# EasyEDA Pro project CobraControl.epro

# Schematic Schematic1
Board Name: Board1; Create Date: 2025-09-19; Page Name: P1; Project Name: CobraControl; Schematic Name: Schematic1; Update Date: 2025-09-19; Company: EasyEDA.com; Page Size: A4; Version: V1.0
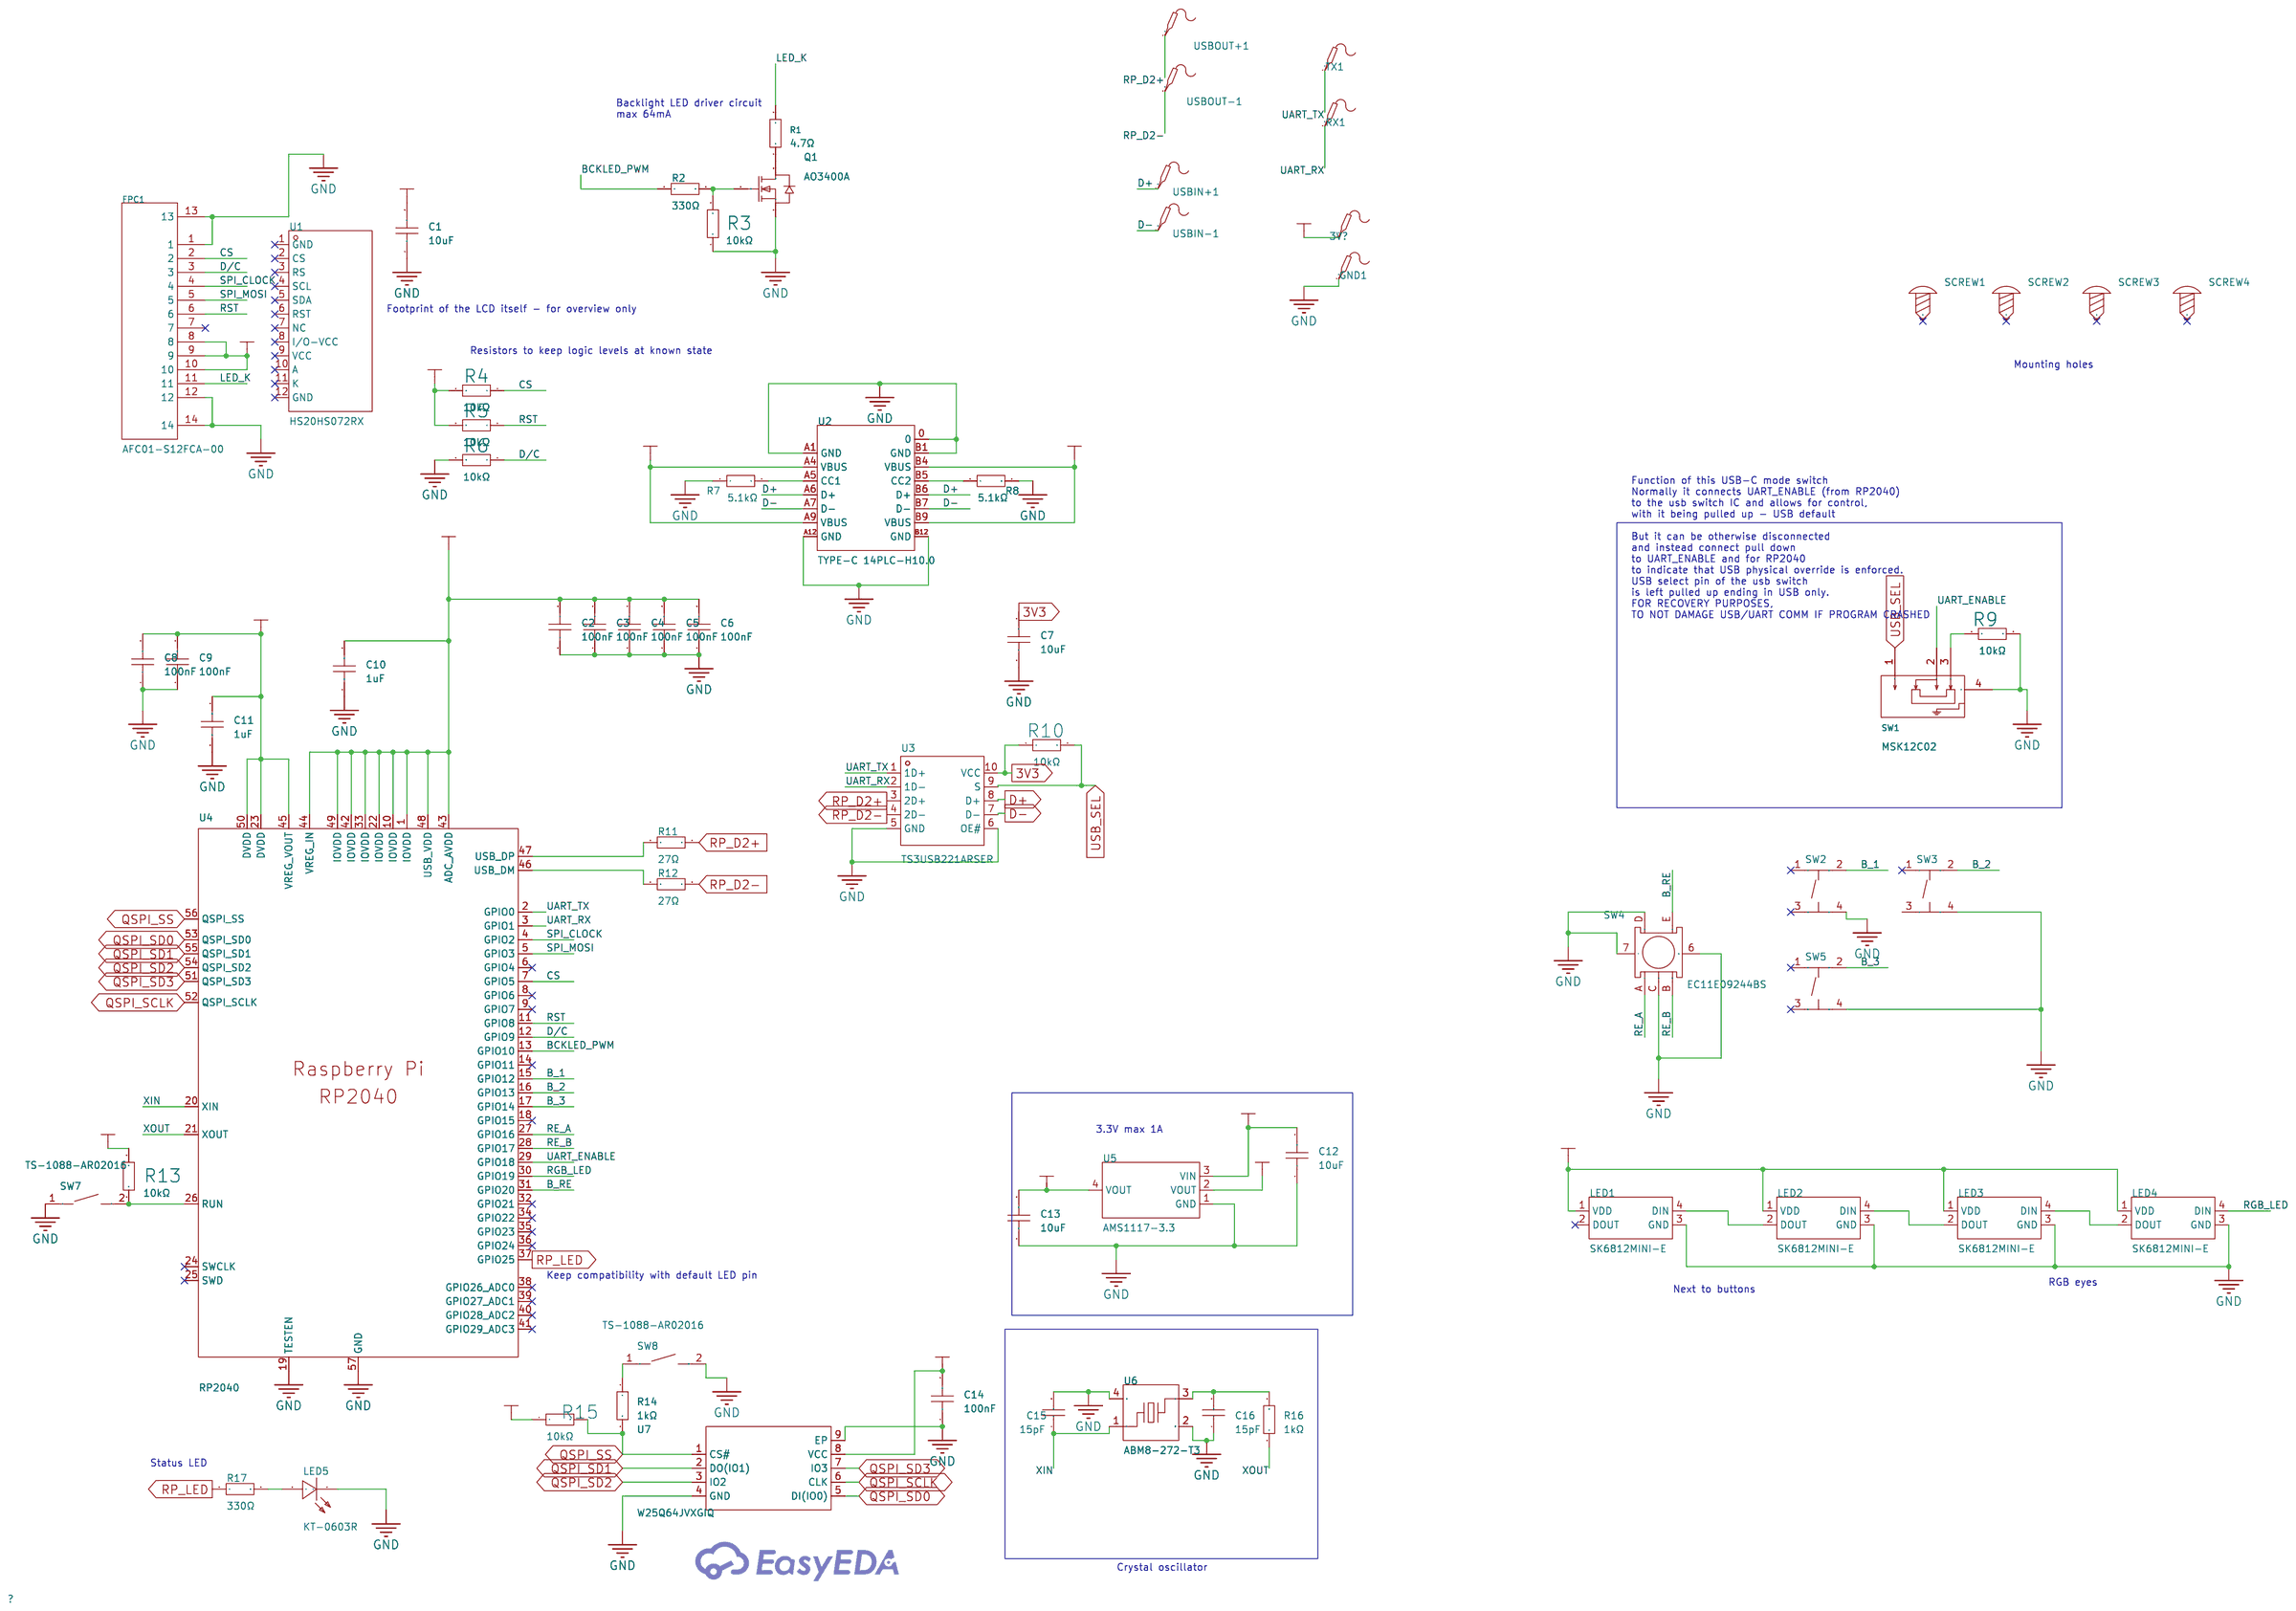
[diagram p0: schematic sheet]

## Parts
3V?#1  -  [Test-Point-0.5mm]
C1  10uF  [C0603]
C2  100nF  [C0402]
C3  100nF  [C0402]
C4  100nF  [C0402]
C5  100nF  [C0402]
C6  100nF  [C0402]
C7  10uF  [C0603]
C8  100nF  [C0402]
C9  100nF  [C0402]
C10  1uF  [C0402]
C11  1uF  [C0402]
C12  10uF  [C0603]
C13  10uF  [C0603]
C14  100nF  [C0402]
C15  15pF  [C0603]
C16  15pF  [C0603]
FPC1  AFC01-S12FCA-00  [FPC-SMD_AFC01-S12FCA-00]
GND1  -  [Test-Point-0.5mm]
LED1  SK6812MINI-E  [LED-SMD_L3.2-W2.8-LS5.9_SK6812MINI-E]
LED2  SK6812MINI-E  [LED-SMD_L3.2-W2.8-LS5.9_SK6812MINI-E]
LED3  SK6812MINI-E  [LED-SMD_L3.2-W2.8-LS5.9_SK6812MINI-E]
LED4  SK6812MINI-E  [LED-SMD_L3.2-W2.8-LS5.9_SK6812MINI-E]
LED5  KT-0603R  [LED0603-RD]
Q1  AO3400A  [SOT-23-3_L2.9-W1.3-P1.90-LS2.4-BR]
R1  4.7Ω  [R0603]
R2  330Ω  [R0402]
R3  10kΩ  [R0402]
R4  10kΩ  [R0402]
R5  10kΩ  [R0402]
R6  10kΩ  [R0402]
R7  5.1kΩ  [R0402]
R8  5.1kΩ  [R0402]
R9  10kΩ  [R0402]
R10  10kΩ  [R0402]
R11  27Ω  [R0603]
R12  27Ω  [R0603]
R13  10kΩ  [R0402]
R14  1kΩ  [R0402]
R15  10kΩ  [R0402]
R16  1kΩ  [R0402]
R17  330Ω  [R0402]
RX1  -  [Test-Point-0.5mm]
SCREW1  -  [Screw-Hole-M3]
SCREW2  -  [Screw-Hole-M3]
SCREW3  -  [Screw-Hole-M3]
SCREW4  -  [Screw-Hole-M3]
SW1  MSK12C02  [SW-TH_MSK12C02]
SW2  TS-1187A-B-A-B  [SW-SMD_4P-L5.1-W5.1-P3.70-LS6.5-TL_H1.5]
SW3  TS-1187A-B-A-B  [SW-SMD_4P-L5.1-W5.1-P3.70-LS6.5-TL_H1.5]
SW4  EC11E09244BS  [SW-TH_EC11XXXXXXXX]
SW5  TS-1187A-B-A-B  [SW-SMD_4P-L5.1-W5.1-P3.70-LS6.5-TL_H1.5]
SW7  TS-1088-AR02016  [SW-SMD_L3.9-W3.0-P4.45]
SW8  TS-1088-AR02016  [SW-SMD_L3.9-W3.0-P4.45]
TX1  -  [Test-Point-0.5mm]
U1  HS20HS072RX  [OLED-SMD_HS20HS072RX]  (no BOM)
U2  TYPE-C 14PLC-H10.0  [USB-C-TH_SHOUHAN_TYPE-C-14PLC-H10.0]
U3  TS3USB221ARSER  [UQFN-10_L2.0-W1.5-P0.50-BL]
U4  RP2040  [LQFN-56_L7.0-W7.0-P0.4-EP]
U5  AMS1117-3.3  [SOT-223-3_L6.5-W3.4-P2.30-LS7.0-BR]
U6  ABM8-272-T3  [CRYSTAL-SMD_4P-L3.2-W2.5-BL]
U7  W25Q64JVXGIQ  [XSON-8_L4.0-W4.0-P0.80-TL-EP]
USBIN+1  -  [Test-Point-0.5mm]
USBIN-1  -  [Test-Point-0.5mm]
USBOUT+1  -  [Test-Point-0.5mm]
USBOUT-1  -  [Test-Point-0.5mm]

## Library data of the parts
3V?#1 GND1 RX1 TX1 USBIN+1 USBIN-1 USBOUT+1 USBOUT-1 = Test-Point: Test Point 测试点
C1 C7 C12 C13 = CL10A106KP8NNNC: Capacitance: Tolerance:±10% Tolerance:±10% Voltage Rated: Temperature Coefficient:; LCSC Part Name: 10uF ±10% 10V; Supplier Part: C19702; Manufacturer: SAMSUNG(三星); Supplier Footprint: 0603; JLCPCB Part Class: Basic Part; Datasheet: https://atta.szlcsc.com/upload/public/pdf/source/20160218/1457707763339.pdf; Supplier: LCSC; Tolerance: ±10%
C2-C6 C8 C9 C14 = CL05B104KO5NNNC: Capacitance: Tolerance:±10% Tolerance:±10% Voltage Rated: Temperature Coefficient:; LCSC Part Name: 100nF ±10% 16V; Supplier Part: C1525; Manufacturer: SAMSUNG(三星); Supplier Footprint: 0402; JLCPCB Part Class: Basic Part; Datasheet: https://atta.szlcsc.com/upload/public/pdf/source/20160218/1457707763339.pdf; Supplier: LCSC; Tolerance: ±10%
C10 C11 = CL05A105KA5NQNC: Capacitance:1uF Tolerance:±10% Tolerance:±10% Voltage Rating:25V Temperature Coefficient:X5R; LCSC Part Name: 1uF ±10% 25V; Supplier Part: C52923; Manufacturer: SAMSUNG(三星); Supplier Footprint: 0402; JLCPCB Part Class: Basic Part; Datasheet: https://item.szlcsc.com/datasheet/CL05A105KA5NQNC/53938.html; Supplier: LCSC; Tolerance: ±10%; Voltage Rating: 25V; Temperature Coefficient: X5R
C15 C16 = CL10C150JB8NNNC: Capacitance: Tolerance:±5% Tolerance:±5% Voltage Rated: Temperature Coefficient:; LCSC Part Name: 15pF ±5% 50V; Supplier Part: C1644; Manufacturer: SAMSUNG(三星); Supplier Footprint: 0603; JLCPCB Part Class: Basic Part; Datasheet: https://atta.szlcsc.com/upload/public/pdf/source/20160218/1457707763339.pdf; Supplier: LCSC; Tolerance: ±5%
FPC1 = AFC01-S12FCA-00: Locking Feature:Hinged Lid Contact Type:Bottom Contact Number of Contacts:12P Pitch:0.5mm Mounting Type:Surface Mount, Right Angle FFC, FCB Thickness:0.3mm FFC, FCB Thickness:0.3mm Height Above Board:2mm; LCSC Part Name: 间距:0.5mm P数:12P 翻盖式 下接; Supplier Part: C262661; Manufacturer: JS(钜硕电子); Supplier Footprint: SMD,P=0.5mm,卧贴; JLCPCB Part Class: Extended Part; Datasheet: https://item.szlcsc.com/datasheet/AFC01-S12FCA-00/253920.html; Supplier: LCSC; Locking Feature: Hinged Lid; Contact Type: Bottom Contact; Number of Contacts: 12P; Pitch: 0.5mm; Mounting Type: Surface Mount, Right Angle; FFC, FCB Thickness: 0.3mm; Height Above Board: 2mm
LED1-LED4 = SK6812MINI-E_C5149201: Supplier Part: C5149201; Manufacturer: 欧思科光电; Supplier Footprint: SMD; JLCPCB Part Class: Extended Part; Datasheet: https://item.szlcsc.com/datasheet/SK6812MINI-E/5773397.html; Supplier: LCSC
LED5 = KT-0603R: Emitted Color:Red Power Dissipation:- Forward Current:- Dominant Wavelength:- Dominant Wavelength:- Peak Wavelength:- Diode Configuration:- Lens Color:- Color Temperature:- Color Temperature:- Viewing Angle:- Mounting Sytle:- Operating Temperature:-40℃~+8; LCSC Part Name: 0603 红灯 高亮; Supplier Part: C2286; Manufacturer: KENTO; Supplier Footprint: 0603; JLCPCB Part Class: Basic Part; Datasheet: https://atta.szlcsc.com/upload/public/pdf/source/20160616/1466072038404.pdf; Supplier: LCSC; Emitted Color: Red; Operating Temperature: -40℃~+85℃
Q1 = AO3400A_C20917: Number:- Drain to Source Voltage:30V Current - Continuous Drain(Id):- RDS(on):48mΩ@2.5V Pd - Power Dissipation:- Gate Threshold Voltage (Vgs(th)):1.45V@250uA Gate Charge(Qg):7nC@10V Input Capacitance(Ciss):630pF@15V Reverse Transfer Capacitance (Crss@Vds); LCSC Part Name: 1个N沟道 耐压:30V 电流:5.7A; Supplier Part: C20917; Manufacturer: AOS; Supplier Footprint: SOT-23-3L; JLCPCB Part Class: Basic Part; Datasheet: https://item.szlcsc.com/datasheet/AO3400A/21629.html; Supplier: LCSC; Drain to Source Voltage: 30V; RDS(on): 48mΩ@2.5V; Gate Threshold Voltage (Vgs(th)): 1.45V@250uA; Gate Charge(Qg): 7nC@10V; Input Capacitance(Ciss): 630pF@15V; Operating Temperature: -55℃~+150℃@(Tj); Type: N-Channel
R1 = 0603WAF470KT5E: Type:Thick Film Resistor Resistance:4.7Ω Tolerance:±1% Tolerance:±1% Power(Watts):100mW Voltage-Supply(Max):75V Temperature Coefficient:±400ppm/℃ Temperature Coefficient:±400ppm/℃ Operating Temperature:-55℃~+155℃ Operating Temperature:-55℃~+155℃; LCSC Part Name: 4.7Ω ±1% 100mW 厚膜电阻; Supplier Part: C23164; Manufacturer: UNI-ROYAL(厚声); Supplier Footprint: 0603; JLCPCB Part Class: Basic Part; Datasheet: https://item.szlcsc.com/datasheet/0603WAF470KT5E/23891.html; Supplier: LCSC; Type: Thick Film Resistor; Tolerance: ±1%; Power(Watts): 100mW; Voltage-Supply(Max): 75V; Temperature Coefficient: ±400ppm/℃; Operating Temperature: -55℃~+155℃
R2 R17 = 0402WGF3300TCE: Type:Thick Film Resistors Resistance:330Ω Tolerance:±1% Tolerance:±1% Power(Watts):1/16W Voltage-Supply(Max):50V Temperature Coefficient:±100ppm/℃ Temperature Coefficient:±100ppm/℃ Operating Temperature:-55℃~+155℃ Operating Temperature:-55℃~+155℃; LCSC Part Name: 330Ω ±1% 62.5mW 厚膜电阻; Supplier Part: C25104; Manufacturer: UNI-ROYAL(厚声); Supplier Footprint: 0402; JLCPCB Part Class: Basic Part; Datasheet: https://item.szlcsc.com/datasheet/0402WGF3300TCE/25847.html; Supplier: LCSC; Type: Thick Film Resistors; Tolerance: ±1%; Power(Watts): 1/16W; Voltage-Supply(Max): 50V; Temperature Coefficient: ±100ppm/℃; Operating Temperature: -55℃~+155℃
R3-R6 R9 R10 R13 R15 = 0402WGF1002TCE: Type:Thick Film Resistors Resistance:10kΩ Tolerance:±1% Tolerance:±1% Power(Watts): Overload Voltage (Max): Temperature Coefficient:±100ppm/℃ Temperature Coefficient:±100ppm/℃ Operating Temperature Range:-55℃~+155℃ Operating Temperature Range:-55℃~+155℃; LCSC Part Name: 10kΩ ±1% 62.5mW 厚膜电阻; Supplier Part: C25744; Manufacturer: UNI-ROYAL(厚声); Supplier Footprint: 0402; JLCPCB Part Class: Basic Part; Datasheet: https://atta.szlcsc.com/upload/public/pdf/source/20200306/C422600_1E6D84923E4A46A82E41ADD87F860B5C.pdf; Supplier: LCSC; Type: Thick Film Resistors; Tolerance: ±1%; Temperature Coefficient: ±100ppm/℃; Operating Temperature Range: -55℃~+155℃
R7 R8 = 0402WGF5101TCE: Type:Thick Film Resistor Resistance:5.1kΩ Tolerance:±1% Tolerance:±1% Power(Watts):62.5mW Voltage-Supply(Max):50V Temperature Coefficient:±100ppm/℃ Temperature Coefficient:±100ppm/℃ Operating Temperature:-55℃~+155℃ Operating Temperature:-55℃~+155℃; LCSC Part Name: 5.1kΩ ±1% 62.5mW 厚膜电阻; Supplier Part: C25905; Manufacturer: UNI-ROYAL(厚声); Supplier Footprint: 0402; JLCPCB Part Class: Basic Part; Datasheet: https://atta.szlcsc.com/upload/public/pdf/source/20200306/C422600_1E6D84923E4A46A82E41ADD87F860B5C.pdf; Supplier: LCSC; Type: Thick Film Resistor; Tolerance: ±1%; Power(Watts): 62.5mW; Voltage-Supply(Max): 50V; Temperature Coefficient: ±100ppm/℃; Operating Temperature: -55℃~+155℃
R11 R12 = 0603WAF270JT5E: Type:Thick Film Resistors Resistance:27Ω Tolerance:±1% Tolerance:±1% Power(Watts): Overload Voltage (Max): Temperature Coefficient:±200ppm/℃ Temperature Coefficient:±200ppm/℃ Operating Temperature Range:-55℃~+155℃ Operating Temperature Range:-55℃~+155℃; LCSC Part Name: 27Ω ±1% 100mW 厚膜电阻; Supplier Part: C25190; Manufacturer: UNI-ROYAL(厚声); Supplier Footprint: 0603; JLCPCB Part Class: Extended Part; Datasheet: https://atta.szlcsc.com/upload/public/pdf/source/20200306/C422600_1E6D84923E4A46A82E41ADD87F860B5C.pdf; Supplier: LCSC; Type: Thick Film Resistors; Tolerance: ±1%; Temperature Coefficient: ±200ppm/℃; Operating Temperature Range: -55℃~+155℃
R14 R16 = 0402WGF1001TCE: Type:Thick Film Resistors Resistance:1kΩ Tolerance:±1% Tolerance:±1% Power(Watts): Overload Voltage (Max): Temperature Coefficient:±100ppm/℃ Temperature Coefficient:±100ppm/℃ Operating Temperature Range:-55℃~+155℃ Operating Temperature Range:-55℃~+155℃; LCSC Part Name: 1kΩ ±1% 62.5mW 厚膜电阻; Supplier Part: C11702; Manufacturer: UNI-ROYAL(厚声); Supplier Footprint: 0402; JLCPCB Part Class: Basic Part; Datasheet: https://atta.szlcsc.com/upload/public/pdf/source/20200306/C422600_1E6D84923E4A46A82E41ADD87F860B5C.pdf; Supplier: LCSC; Type: Thick Film Resistors; Tolerance: ±1%; Temperature Coefficient: ±100ppm/℃; Operating Temperature Range: -55℃~+155℃
SCREW1-SCREW4 = Screw-Hole-M3: Supplier Footprint: 插件
SW1 = MSK12C02: Circuit:SPDT Actuator Style:- Pin Style:SMDSplicing Switch Length:8mm Switch Width:2.8mm Switch Height:1.4mm Mounting Style:卧贴 Actuator Color:- Current Rating (DC):50mA Voltage Rating (DC):12V Current Rating (AC):- Voltage Rating (AC):- Mechanical Life:1万; LCSC Part Name: 两档侧拨贴片 7脚 滑动开关; Supplier Part: C431540; Manufacturer: SHOU HAN(首韩); Supplier Footprint: SMD; JLCPCB Part Class: Extended Part; Datasheet: https://atta.szlcsc.com/upload/public/pdf/source/20190925/C431540_89155AEF0758B9AD1B2D805F83FB12E3.pdf; Supplier: LCSC; Circuit: SPDT; Pin Style: SMDSplicing; Switch Length: 8mm; Switch Width: 2.8mm; Switch Height: 1.4mm; Mounting Style: 卧贴; Current Rating (DC): 50mA; Voltage Rating (DC): 12V; Mechanical Life: 1万次; Operating Temperature: -20℃~+70℃
SW2 SW3 SW5 = TS-1187A-B-A-B: Circuit:SPST Actuator Style:Round Button Operating Force:1.6N Mounting Type:Surface Mount,Vertical Length:5.1mm Width:5.1mm Switch Height:1.5mm with Bracket:Without Bracket Contact Current:50mA Voltage Rating:12V Actuator/Cap Color:Gold With Lamp:No Life:; LCSC Part Name: 5.1*5.1*1.5mm 立贴 轻触开关; Supplier Part: C318884; Manufacturer: XKB Connection(中国星坤); Supplier Footprint: SMD; JLCPCB Part Class: Basic Part; Datasheet: https://item.szlcsc.com/datasheet/TS-1187A-B-A-B/299976.html; Supplier: LCSC; Circuit: SPST; Actuator Style: Round Button; Operating Force: 1.6N; Mounting Type: Surface Mount,Vertical; Length: 5.1mm; Width: 5.1mm; Switch Height: 1.5mm; with Bracket: Without Bracket; Contact Current: 50mA; Voltage Rating: 12V; Actuator/Cap Color: Gold; With Lamp: No; Life: 100,000 Cycles; Operating Temperature: -30℃~+85℃
SW4 = EC11E09244BS: Supplier Part: C470742; Manufacturer: ALPSALPINE(阿尔卑斯阿尔派); Supplier Footprint: 插件; JLCPCB Part Class: Extended Part; Datasheet: https://atta.szlcsc.com/upload/public/pdf/source/20191216/C470795_DE763ECE59BD49533DB26DB53E5D34B2.pdf; Supplier: LCSC
SW7 SW8 = TS-1088-AR02016: Circuit:SPST Actuator Style:Round Button Operating Force:160gf Mounting Style:Brick nogging Switch Length:4mm Switch Width:3mm Switch Height:2mm Strike Gundam:不带 Contact Current:50mA Voltage Rating (DC):12V Insulation Resistance:100MΩ Actuator/Cap Color:B; LCSC Part Name: 4*3*2mm 立贴 轻触开关; Supplier Part: C720477; Manufacturer: XUNPU(讯普); Supplier Footprint: SMD; JLCPCB Part Class: Basic Part; Datasheet: https://atta.szlcsc.com/upload/public/pdf/source/20200810/C720475_60D09DD6C54279ADDB2DC25100F1CC11.pdf; Supplier: LCSC; Circuit: SPST; Actuator Style: Round Button; Operating Force: 160gf; Mounting Style: Brick nogging; Switch Length: 4mm; Switch Width: 3mm; Switch Height: 2mm; Strike Gundam: 不带; Contact Current: 50mA; Voltage Rating (DC): 12V; Insulation Resistance: 100MΩ; Actuator/Cap Color: Black; Pin Style: SMDSplicing; Mechanical Life: 10万次; Operating Temperature: -30℃~+80℃
U1 = HS20HS072RX: Controller Type:ST7789 Size:2 Dot Pixels:320x240 Operating Temperature:-20℃~+70℃ Operating Temperature:-20℃~+70℃; LCSC Part Name: 2.0寸240*320(RGB)彩色SPI串口TFT液晶显示屏; Supplier Part: C5329582; Manufacturer: HS(汉昇); JLCPCB Part Class: Extended Part; Datasheet: https://atta.szlcsc.com/upload/public/pdf/source/20221215/8081666AF7BFDE257CAA474692F2FEBB.pdf; Supplier: LCSC; Controller Type: ST7789; Size: 2; Dot Pixels: 320x240; Operating Temperature: -20℃~+70℃
U2 = TYPE-C 14PLC-H10.0: Connector Type:Type-C Protocol Standard:USB 3.1 Gender:Female Mounting Type:Through Hole Number of Contacts:14P Number of Ports:1 Current Rating-Power:5A Voltage Rating:20V Connect-Disconnect Life:10,000 Cycles Detection color:Black Operating Temperature:; LCSC Part Name: Type-C 母 直插; Supplier Part: C3151746; Manufacturer: SHOU HAN(首韩); Supplier Footprint: 插件; JLCPCB Part Class: Extended Part; Datasheet: https://item.szlcsc.com/datasheet/TYPE-C%252014PLC-H10.0/3712564.html; Supplier: LCSC; Connector Type: Type-C; Protocol Standard: USB 3.1; Gender: Female; Mounting Type: Through Hole; Number of Contacts: 14P; Number of Ports: 1; Current Rating-Power: 5A; Voltage Rating: 20V; Connect-Disconnect Life: 10,000 Cycles; Detection color: Black; Operating Temperature: -40℃~+85℃
U3 = TS3USB221ARSER: Switch Circuit:SPDT(SPDT) -3dB Bandwidth:900MHz Voltage - Supply:2.5V~3.3V Voltage - Supply:2.5V~3.3V RDS(on):6Ω Operating Temperature:-40℃~+85℃ Operating Temperature:-40℃~+85℃; LCSC Part Name: TS3USB221A ESD保护、高速USB2.0 (480-Mbps) 1:2多路复用器和解复用器开关，带单使能; Supplier Part: C128396; Manufacturer: TI(德州仪器); Supplier Footprint: UQFN-10(1.5x2); JLCPCB Part Class: Extended Part; Datasheet: https://www.ti.com/cn/lit/gpn/ts3usb221a; Supplier: LCSC; Switch Circuit: SPDT(SPDT); -3dB Bandwidth: 900MHz; Voltage - Supply: 2.5V~3.3V; RDS(on): 6Ω; Operating Temperature: -40℃~+85℃
U4 = RP2040_C2040: CPU Core:- CPU Maximum Speed:133MHz Number of I/O:30 ADC (Bit):12bit Applications:-; LCSC Part Name: RP2040（RP2B2）; Supplier Part: C2040; Manufacturer: Raspberry Pi(树莓派); Supplier Footprint: LQFN-56(7x7); JLCPCB Part Class: Extended Part; Datasheet: https://atta.szlcsc.com/upload/public/pdf/source/20210621/C2040_96F425825606B7957D87DD32E2512CA9.pdf; Supplier: LCSC; CPU Maximum Speed: 133MHz; Number of I/O: 30; ADC (Bit): 12bit
U5 = AMS1117-3.3_C6186: Output Type:Fixed Voltage - Supply:16V Output Voltage:3.3V Output Voltage:3.3V Output Current:1A Power Supply Rejection Ratio (PSRR):72dB@(120Hz) Voltage Dropout:1.1V@(800mA) standby current:5mA Noise:- Features:Over Current Protection；Over Temperature Pr; LCSC Part Name: 输出3.3V 1A; Supplier Part: C6186; Manufacturer: AMS; Supplier Footprint: SOT-223; JLCPCB Part Class: Basic Part; Datasheet: https://item.szlcsc.com/datasheet/AMS1117-3.3/6652.html; Supplier: LCSC; Output Type: Fixed; Voltage - Supply: 16V; Output Voltage: 3.3V; Output Current: 1A; Power Supply Rejection Ratio (PSRR): 72dB@(120Hz); Voltage Dropout: 1.1V@(800mA); standby current: 5mA; Features: Over Current Protection；Over Temperature Protection; Operating Temperature: -40℃~+125℃; Output Configuration: Positive; Number of Outputs: 1
U6 = ABM8-272-T3_C20625731: Supplier Part: C20625731; Manufacturer: ABRACON; Supplier Footprint: SMD3225-4P; JLCPCB Part Class: Extended Part; Datasheet: https://atta.szlcsc.com/upload/public/pdf/source/20240227/A8BE43F636D80F75C9AF5C59EDF21E9A.pdf; Supplier: LCSC
U7 = W25Q64JVXGIQ: Interface:SPI Memory Size:64Mbit Clock Frequency:133MHz Voltage - Supply:2.7V~3.6V Voltage - Supply:2.7V~3.6V Program / Erase Cycles:100,000 Cycles Page Programming Time (Tpp):3ms Data Retention - TDR (Year):20 Years; Supplier Part: C2940195; Manufacturer: Winbond(华邦); Supplier Footprint: XSON-8-EP(4x4); JLCPCB Part Class: Extended Part; Datasheet: https://atta.szlcsc.com/upload/public/pdf/source/20220111/96C134BA110DAC08742B3CB6C4519B4C.pdf; Supplier: LCSC; Interface: SPI; Memory Size: 64Mbit; Clock Frequency: 133MHz; Voltage - Supply: 2.7V~3.6V; Program / Erase Cycles: 100,000 Cycles; Page Programming Time (Tpp): 3ms; Data Retention - TDR (Year): 20 Years

## Nets
1V1: C8.2 C9.2 C11.2 U4.23(DVDD) U4.45(VREG_VOUT) U4.50(DVDD)
3V3: 3V?#1.1 C1.2 C2.2 C3.2 C4.2 C5.2 C6.2 C7.2 C10.2 C13.2 C14.2 FPC1.8 FPC1.9 FPC1.10 R4.2 R5.2 R10.1 R13.2 R15.1 U3.10(VCC) U4.1(IOVDD) U4.10(IOVDD) U4.22(IOVDD) U4.33(IOVDD) U4.42(IOVDD) U4.43(ADC_AVDD) U4.44(VREG_IN) U4.48(USB_VDD) U4.49(IOVDD) U5.2(VOUT) U5.4(VOUT) U7.8(VCC)
GND: C1.1 C2.1 C3.1 C4.1 C5.1 C6.1 C7.1 C8.1 C9.1 C10.1 C11.1 C12.1 C13.1 C14.1 C15.2 C16.1 FPC1.1 FPC1.12 FPC1.13 FPC1.14 GND1.1 LED1.3(GND) LED2.3(GND) LED3.3(GND) LED4.3(GND) LED5.1(K) Q1.2(S) R3.1 R6.2 R7.1 R8.2 R9.2 SW1.4 SW2.4(D) SW3.4(D) SW4.6 SW4.7 SW4.C SW4.D SW5.4(D) SW7.1 SW8.2 U2.0 U2.A1(GND) U2.A12(GND) U2.B1(GND) U2.B12(GND) U3.5(GND) U3.6(OE#) U4.19(TESTEN) U4.57(GND) U5.1(GND) U6.2(GND) U6.4(GND) U7.4(GND) U7.9(EP)
B_1: SW2.2(B) U4.15(GPIO12)
B_2: SW3.2(B) U4.16(GPIO13)
B_3: SW5.2(B) U4.17(GPIO14)
B_RE: SW4.E U4.31(GPIO20)
BCKLED_PWM: R2.1 U4.13(GPIO10)
CS: FPC1.2 R4.1 U4.7(GPIO5)
D+: U2.A6(D+) U2.B6(D+) U3.8(D+) USBIN+1.1
D-: U2.A7(D-) U2.B7(D-) U3.7(D-) USBIN-1.1
D/C: FPC1.3 R6.1 U4.12(GPIO9)
LED_K: FPC1.11 R1.2
QSPI_SCLK: U4.52(QSPI_SCLK) U7.6(CLK)
QSPI_SD0: U4.53(QSPI_SD0) U7.5(DI(IO0))
QSPI_SD1: U4.55(QSPI_SD1) U7.2(DO(IO1))
QSPI_SD2: U4.54(QSPI_SD2) U7.3(IO2)
QSPI_SD3: U4.51(QSPI_SD3) U7.7(IO3)
QSPI_SS: R14.2 R15.2 U4.56(QSPI_SS) U7.1(CS#)
RE_A: SW4.A U4.27(GPIO16)
RE_B: SW4.B U4.28(GPIO17)
RGB_LED: LED4.4(DIN) U4.30(GPIO19)
RP_D2+: R11.2 U3.3(2D+) USBOUT+1.1
RP_D2-: R12.2 U3.4(2D-) USBOUT-1.1
RP_LED: R17.1 U4.37(GPIO25)
RST: FPC1.6 R5.1 U4.11(GPIO8)
SPI_CLOCK: FPC1.4 U4.4(GPIO2)
SPI_MOSI: FPC1.5 U4.5(GPIO3)
UART_ENABLE: SW1.2 U4.29(GPIO18)
UART_RX: RX1.1 U3.2(1D-) U4.3(GPIO1)
UART_TX: TX1.1 U3.1(1D+) U4.2(GPIO0)
USB_SEL: R10.2 SW1.1 U3.9(S)
VUSB: C12.2 LED1.1(VDD) LED2.1(VDD) LED3.1(VDD) LED4.1(VDD) U2.A4(VBUS) U2.A9(VBUS) U2.B4(VBUS) U2.B9(VBUS) U5.3(VIN)
XIN: C15.1 U4.20(XIN) U6.1
XOUT: R16.1 U4.21(XOUT)
$1N3240: LED5.2(A) R17.2
$1N3243: C16.2 R16.2 U6.3
$1N3267: R11.1 U4.47(USB_DP)
$1N3269: R12.1 U4.46(USB_DM)
$1N3437: R7.2 U2.A5(CC1)
$1N3441: R8.1 U2.B5(CC2)
$1N3877: R9.1 SW1.3
$1N5974: LED1.4(DIN) LED2.2(DOUT)
$1N6041: LED3.4(DIN) LED4.2(DOUT)
$1N6047: LED2.4(DIN) LED3.2(DOUT)
Net-(Q1-1): Q1.1(G) R2.2 R3.2
Net-(Q1-3): Q1.3(D) R1.1
Net-(R13-1): R13.1 SW7.2 U4.26(RUN)
Net-(R14-1): R14.1 SW8.1

Not connected (* = marked no-connect by the designer): FPC1 7*; LED1 2(DOUT)*; SCREW1 1*; SCREW2 1*; SCREW3 1*; SCREW4 1*; SW2 1(A)* 3(C)*; SW3 1(A)* 3(C); SW5 1(A)* 3(C)*; U1 1(GND)* 2(CS)* 3(RS)* 4(SCL)* 5(SDA)* 6(RST)* 7(NC)* 8(I/O-VCC)* 9(VCC)* 10(A)* 11(K)* 12(GND)*; U4 6(GPIO4)* 8(GPIO6)* 9(GPIO7)* 14(GPIO11)* 18(GPIO15)* 24(SWCLK)* 25(SWD)* 32(GPIO21)* 34(GPIO22)* 35(GPIO23)* 36(GPIO24)* 38(GPIO26_ADC0)* 39(GPIO27_ADC1)* 40(GPIO28_ADC2)* 41(GPIO29_ADC3)*

## Notes on the sheet
- Backlight LED driver circuit
  max 64mA
- Footprint of the LCD itself - for overview only
- Resistors to keep logic levels at known state
- Mounting holes
- Function of this USB-C mode switch
  Normally it connects UART_ENABLE (from RP2040)
  to the usb switch IC and allows for control,
  with it being pulled up - USB default
  But it can be otherwise disconnected
  and instead connect pull down
  to UART_ENABLE and for RP2040
  to indicate that USB physical override is enforced.
  USB select pin of the usb switch
  is left pulled up ending in USB only.
  FOR RECOVERY PURPOSES,
  TO NOT DAMAGE USB/UART COMM IF PROGRAM CRASHED
- 3.3V max 1A
- Keep compatibility with default LED pin
- Next to buttons
- RGB eyes
- Status LED
- Crystal oscillator

# Board PCB1
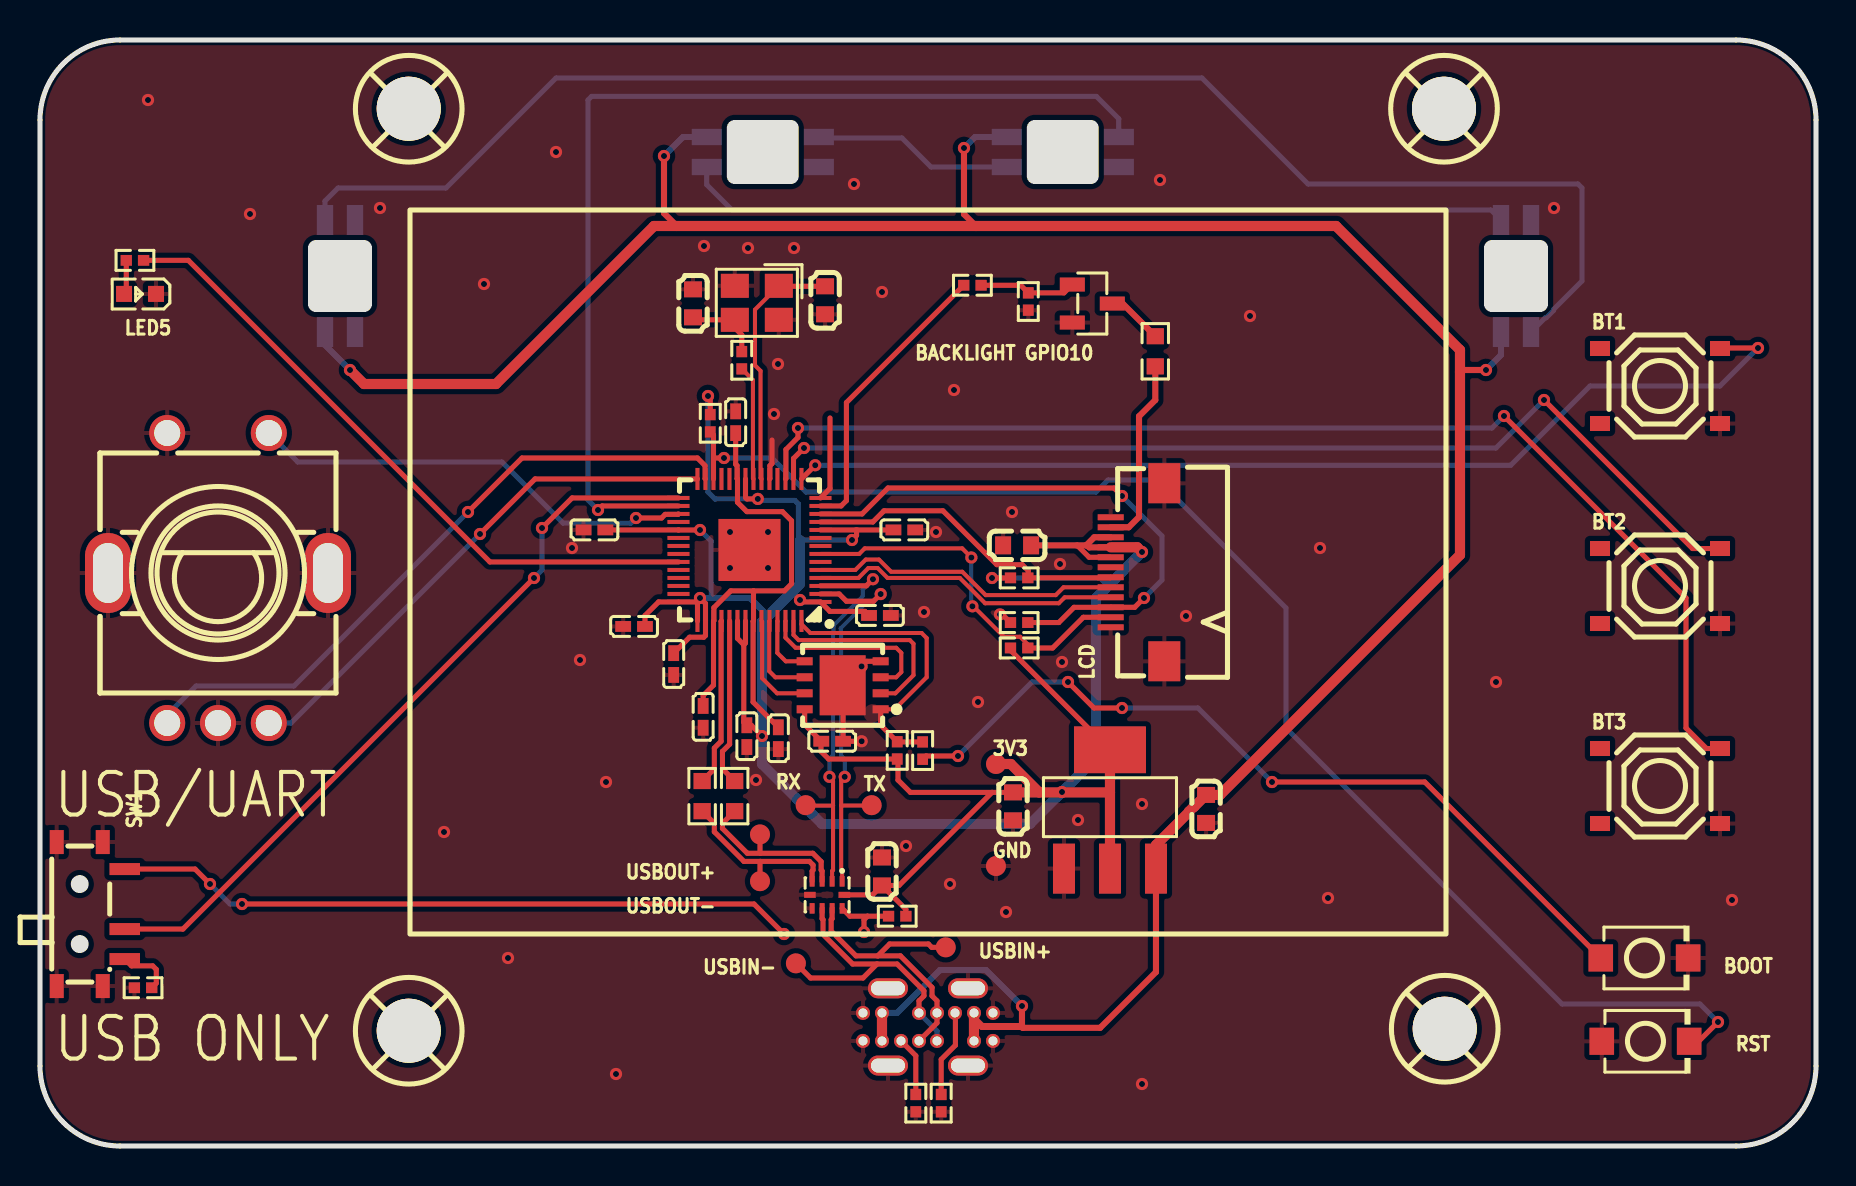
[diagram p1: board, top side]
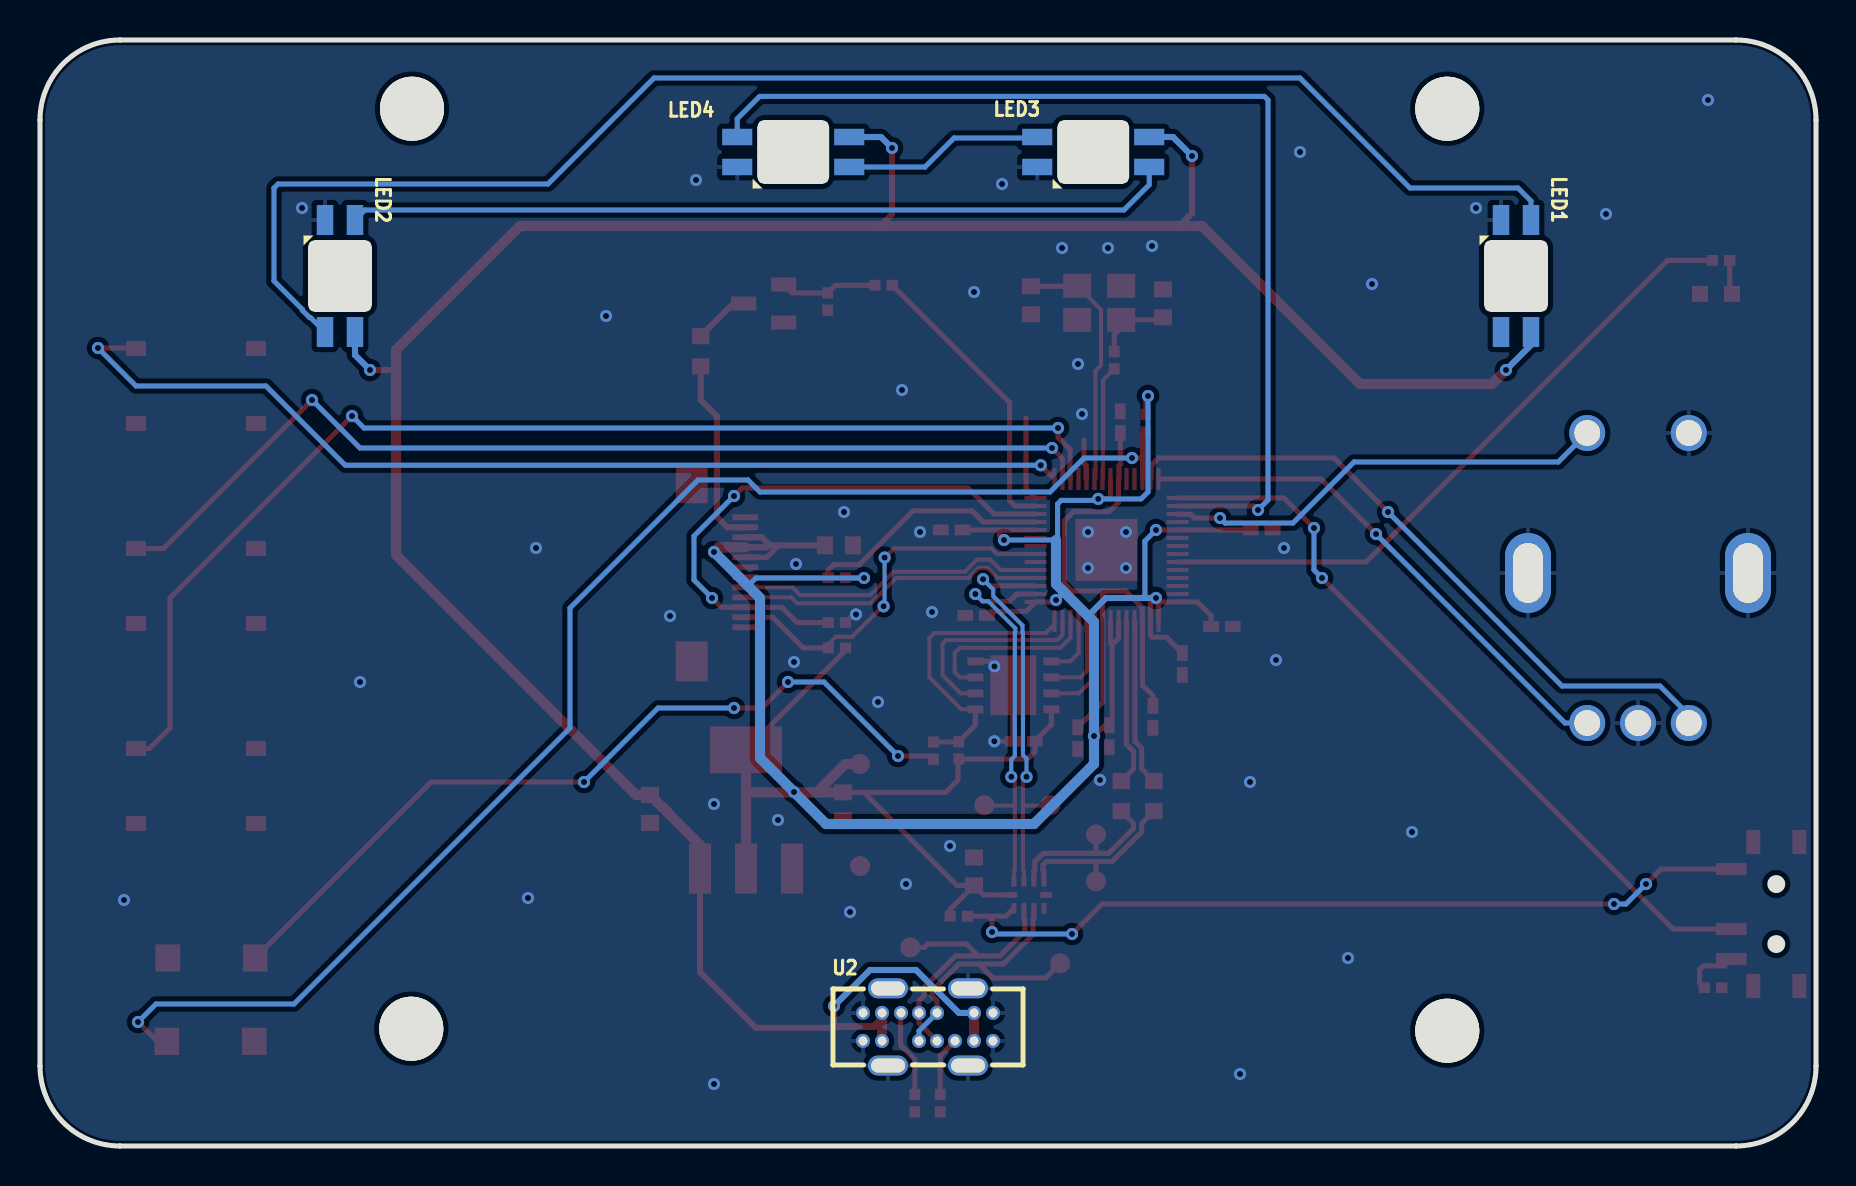
[diagram p2: board, bottom side, seen from below]

Outline 88.8 x 55.3 mm; copper layers: Top Layer, Bottom Layer. Coordinates in mm from the lower left corner of the outline.
Outline path: 0,51.3 0,4 arc(1.17,1.17) 4,0 84.8,0 arc(87.63,1.17) 88.8,4 88.8,51.3 arc(87.63,54.13) 84.8,55.3 4,55.3 arc(1.17,54.13) 0,51.3
Stack: Top Layer 0.035mm / Dielectric1 1.51mm FR4 er 4.5 / Bottom Layer 0.035mm

## Design rules (mm)
net D+: DP2
net D-: DP2
net RP_D2+: RP_USB
net $1N3267: DP1
net RP_D2-: RP_USB
net $1N3269: DP1
net UART_TX: RP_UART
net UART_RX: RP_UART
template: Custom Config
spacing copperThickness1oz (default): track to track 0.102, other pairs 0 to 0.3
spacing copperThickness2oz: track to track 0.203, other pairs 0.152 to 0.3
track width copperThickness1oz (default): min 0.127, default 0.254, max 2.54
track width copperThickness2oz: min 0.203, default 0.254, max 2.54
differential pair differentialPair (default): width min 0.127, default 0.254, max 2.54; gap min 0.152, default 0.152
via viaSize (default): diameter min 0.5, default 0.61, max 10; hole min 0.3, default 0.305, max 6.3

## Placement (name value [footprint] x y rotation side)
3V3  -  [Test-Point-0.5mm]  47.8 19.1 0 top
BACKLIGHT GPIO10  AO3400A  [SOT-23-3_L2.9-W1.3-P1.90-LS2.4-BR]  52.61 42.12 180 top
BOOT  TS-1088-AR02016  [SW-SMD_L3.9-W3.0-P4.45]  80.22 9.4 0 top
BT1  TS-1187A-B-A-B  [SW-SMD_4P-L5.1-W5.1-P3.70-LS6.5-TL_H1.5]  81 38 0 top
BT2  TS-1187A-B-A-B  [SW-SMD_4P-L5.1-W5.1-P3.70-LS6.5-TL_H1.5]  81 28 0 top
BT3  TS-1187A-B-A-B  [SW-SMD_4P-L5.1-W5.1-P3.70-LS6.5-TL_H1.5]  81 18 0 top
C1  10uF  [C0603]  48.85 30.03 0 top
C2  100nF  [C0402]  31.69 24.1 90 top
C3  100nF  [C0402]  29.7 25.98 0 top
C4  100nF  [C0402]  27.72 30.8 0 top
C5  100nF  [C0402]  43.22 30.8 180 top
C6  100nF  [C0402]  42 26.53 180 top
C7  10uF  [C0603]  42.1 13.73 270 top
C8  100nF  [C0402]  36.92 20.39 90 top
C9  100nF  [C0402]  34.78 36.19 270 top
C10  1uF  [C0402]  35.34 20.49 90 top
C11  1uF  [C0402]  33.16 21.46 90 top
C12  10uF  [C0603]  58.3 16.85 90 top
C13  10uF  [C0603]  48.65 16.98 90 top
C14  100nF  [C0402]  39.61 20.24 180 top
C15  15pF  [C0603]  39.25 42.29 270 top
C16  15pF  [C0603]  32.65 42.13 270 top
GND  -  [Test-Point-0.5mm]  47.8 14 0 top
LCD  AFC01-S12FCA-00  [FPC-SMD_AFC01-S12FCA-00]  54.88 28.69 90 top
LED1  SK6812MINI-E  [LED-SMD_L3.2-W2.8-LS5.9_SK6812MINI-E]  15 43.5 270 bottom
LED2  SK6812MINI-E  [LED-SMD_L3.2-W2.8-LS5.9_SK6812MINI-E]  73.8 43.5 270 bottom
LED3  SK6812MINI-E  [LED-SMD_L3.2-W2.8-LS5.9_SK6812MINI-E]  36.14 49.7 180 bottom
LED4  SK6812MINI-E  [LED-SMD_L3.2-W2.8-LS5.9_SK6812MINI-E]  51.14 49.7 180 bottom
LED5  KT-0603R  [LED0603-RD]  5 42.61 180 top
R1  4.7Ω  [R0603]  55.76 39.74 270 top
R2  330Ω  [R0402]  46.62 43.04 0 top
R3  10kΩ  [R0402]  49.41 42.22 90 top
R4  10kΩ  [R0402]  48.96 24.9 180 top
R5  10kΩ  [R0402]  48.96 28.41 180 top
R6  10kΩ  [R0402]  48.96 26.17 180 top
R7  5.1kΩ  [R0402]  45.06 2.14 90 top
R8  5.1kΩ  [R0402]  43.79 2.14 270 top
R9  10kΩ  [R0402]  5.15 7.91 180 top
R10  10kΩ  [R0402]  42.86 11.49 180 top
R11  27Ω  [R0603]  34.73 17.49 270 top
R12  27Ω  [R0603]  33.11 17.49 270 top
R13  10kΩ  [R0402]  33.51 36.14 90 top
R14  1kΩ  [R0402]  44.13 19.77 90 top
R15  10kΩ  [R0402]  42.86 19.78 90 top
R16  1kΩ  [R0402]  35.09 39.29 90 top
R17  330Ω  [R0402]  4.75 44.28 180 top
RST  TS-1088-AR02016  [SW-SMD_L3.9-W3.0-P4.45]  80.27 5.24 0 top
RX  -  [Test-Point-0.5mm]  38.28 17.04 0 top
SCREW1  -  [Screw-Hole-M3]  18.5 51.8 0 top
SCREW2  -  [Screw-Hole-M3]  70.26 51.8 0 top
SCREW3  -  [Screw-Hole-M3]  18.5 5.7 0 top
SCREW4  -  [Screw-Hole-M3]  70.3 5.8 0 top
SW1  MSK12C02  [SW-TH_MSK12C02]  2.54 11.6 270 top
SW4  EC11E09244BS  [SW-TH_EC11XXXXXXXX]  8.9 28.4 0 top
TX  -  [Test-Point-0.5mm]  41.58 17.04 0 top
U2  TYPE-C 14PLC-H10.0  [USB-C-TH_SHOUHAN_TYPE-C-14PLC-H10.0]  44.4 5.95 180 bottom
U3  TS3USB221ARSER  [UQFN-10_L2.0-W1.5-P0.50-BL]  39.36 12.56 180 top
U4  RP2040  [LQFN-56_L7.0-W7.0-P0.4-EP]  35.47 29.8 180 top
U5  AMS1117-3.3  [SOT-223-3_L6.5-W3.4-P2.30-LS7.0-BR]  53.5 16.84 270 top
U6  ABM8-272-T3  [CRYSTAL-SMD_4P-L3.2-W2.5-BL]  35.84 42.16 180 top
U7  W25Q64JVXGIQ  [XSON-8_L4.0-W4.0-P0.80-TL-EP]  40.13 23.04 180 top
USBIN+  -  [Test-Point-0.5mm]  45.29 9.93 270 top
USBIN-  -  [Test-Point-0.5mm]  37.79 9.13 270 top
USBOUT+  -  [Test-Point-0.5mm]  36 15.58 0 top
USBOUT-  -  [Test-Point-0.5mm]  36 13.24 0 top

## Footprints (pads in the part's own frame, mm; a bottom-side part is the same pattern mirrored in y, then rotated)
C0402
  rect 0.79x0.54 smd: 1(-0.545,0) 2(0.545,0)
C0603
  rect 0.8x0.9 smd: 1(-0.7,0) 2(0.7,0)
CRYSTAL-SMD_4P-L3.2-W2.5-BL
  rect 1.4x1.2 smd: 1(-1.1,-0.85) 2(1.1,-0.85) 3(1.1,0.85) 4(-1.1,0.85)
FPC-SMD_AFC01-S12FCA-00
  rect 0.3x1.3 smd: 1(-2.751,1.341) 2(-2.251,1.341) 3(-1.751,1.341) 4(-1.25,1.341) 5(-0.75,1.341) 6(-0.249,1.341) 7(0.251,1.341) 8(0.75,1.341) 9(1.249,1.341) 10(1.75,1.341) 11(2.249,1.341) 12(2.75,1.341)
  rect 2x1.6 smd: 13(-4.45,-1.34) 14(4.45,-1.341)
LED0603-RD
  rect 0.8x0.8 smd: 1(-0.799,0) 2(0.799,0)
LED-SMD_L3.2-W2.8-LS5.9_SK6812MINI-E
  rect 1.5x0.82 smd: 1(2.8,0.75) 2(2.8,-0.75) 3(-2.8,-0.75) 4(-2.8,0.75)
LQFN-56_L7.0-W7.0-P0.4-EP
  rect 1.1x0.2 smd: 1(-3.55,2.6) 2(-3.55,2.2) 3(-3.55,1.8) 4(-3.55,1.4) 5(-3.55,1) 6(-3.55,0.6) 7(-3.55,0.2) 8(-3.55,-0.2) 9(-3.55,-0.6) 10(-3.55,-1) 11(-3.55,-1.4) 12(-3.55,-1.8) 13(-3.55,-2.2) 14(-3.55,-2.6) 29(3.55,-2.6) 30(3.55,-2.2) 31(3.55,-1.8) 32(3.55,-1.4) 33(3.55,-1) 34(3.55,-0.6) 35(3.55,-0.2) 36(3.55,0.2) 37(3.55,0.6) 38(3.55,1) 39(3.55,1.4) 40(3.55,1.8) 41(3.55,2.2) 42(3.55,2.6)
  rect 0.2x1.1 smd: 15(-2.6,-3.55) 16(-2.2,-3.55) 17(-1.8,-3.55) 18(-1.4,-3.55) 19(-1,-3.55) 20(-0.6,-3.55) 21(-0.2,-3.55) 22(0.2,-3.55) 23(0.6,-3.55) 24(1,-3.55) 25(1.4,-3.55) 26(1.8,-3.55) 27(2.2,-3.55) 28(2.6,-3.55) 43(2.6,3.55) 44(2.2,3.55) 45(1.8,3.55) 46(1.4,3.55) 47(1,3.55) 48(0.6,3.55) 49(0.2,3.55) 50(-0.2,3.55) 51(-0.6,3.55) 52(-1,3.55) 53(-1.4,3.55) 54(-1.8,3.55) 55(-2.2,3.55) 56(-2.6,3.55)
  rect 3.1x3.1 smd: 57(0,0)
R0402
  rect 0.566x0.54 smd: 1(-0.433,0) 2(0.433,0)
R0603
  rect 0.806x0.864 smd: 1(-0.753,0) 2(0.753,0)
Screw-Hole-M3
  round 3.2 hole 3.2: 1(-0.064,0.064)
SOT-23-3_L2.9-W1.3-P1.90-LS2.4-BR
  rect 1.25x0.7 smd: 1(1,-0.95) 2(1,0.95) 3(-1,0)
SOT-223-3_L6.5-W3.4-P2.30-LS7.0-BR
  rect 2.5x1.1 smd: 1(2.97,-2.3) 2(2.97,0) 3(2.97,2.3)
  rect 2.34x3.6 smd: 4(-2.97,0)
SW-SMD_4P-L5.1-W5.1-P3.70-LS6.5-TL_H1.5
  rect 1x0.75 smd: 1(-3,1.875) 2(3,1.875) 3(-3,-1.875) 4(3,-1.875)
SW-SMD_L3.9-W3.0-P4.45
  rect 1.23x1.36 smd: 1(-2.185,0) 2(2.185,0)
SW-TH_EC11XXXXXXXX
  oval 2.3x4 hole 1.5x3: 6(5.5,0.25) 7(-5.5,0.25)
  round 1.8 hole 1.3: A(-2.54,-7.25) B(2.54,-7.25) C(0,-7.25) D(-2.54,7.25) E(2.54,7.25)
SW-TH_MSK12C02
  rect 0.6x1.524 smd: 1(-2.25,1.7) 2(0.75,1.7) 3(2.25,1.7)
  rect 1.2x0.7 smd: 4(-3.6,0.6) 4(-3.6,-1.7) 4(3.6,0.6) 4(3.6,-1.7)
Test-Point-0.5mm
  round 1 smd: 1(0,0)
UQFN-10_L2.0-W1.5-P0.50-BL
  rect 0.25x0.525 smd: 1(-0.75,-0.675) 2(-0.25,-0.675) 3(0.25,-0.675) 4(0.75,-0.675) 6(0.75,0.675) 7(0.25,0.675) 8(-0.25,0.675) 9(-0.75,0.675)
  rect 0.58x0.3 smd: 5(0.86,0) 10(-0.86,0)
USB-C-TH_SHOUHAN_TYPE-C-14PLC-H10.0
  oval 2x1 hole 1.7x0.7: 0(-2,-1.93) 0(-2,1.93) 0(2,-1.93) 0(2,1.93)
  round 0.7 hole 0.45: A1(-3.25,0.7) A4(-2.3,0.7) A5(-1.35,0.7) A6(-0.45,0.7) A7(0.45,0.7) A9(2.3,0.7) A12(3.25,0.7) B1(3.25,-0.7) B4(2.3,-0.7) B5(1.35,-0.7) B6(0.45,-0.7) B7(-0.45,-0.7) B9(-2.3,-0.7) B12(-3.25,-0.7)
XSON-8_L4.0-W4.0-P0.80-TL-EP
  rect 0.8x0.4 smd: 1(-1.9,1.2) 2(-1.9,0.4) 3(-1.9,-0.4) 4(-1.9,-1.2) 5(1.9,-1.2) 6(1.9,-0.4) 7(1.9,0.4) 8(1.9,1.2)
  rect 2.3x3 smd: 9(0,0)

## Nets
1V1: C8.2 C9.2 C11.2 U4.23 U4.45 U4.50
3V3: 3V3.1 C1.2 C2.2 C3.2 C4.2 C5.2 C6.2 C7.2 C10.2 C13.2 C14.2 LCD.8 LCD.9 LCD.10 R4.2 R5.2 R10.1 R13.2 R15.1 U3.10 U4.1 U4.10 U4.22 U4.33 U4.42 U4.43 U4.44 U4.48 U4.49 U5.2 U5.4 U7.8
GND: BACKLIGHT GPIO10.2 BOOT.2 BT1.4 BT2.4 BT3.4 C1.1 C2.1 C3.1 C4.1 C5.1 C6.1 C7.1 C8.1 C9.1 C10.1 C11.1 C12.1 C13.1 C14.1 C15.2 C16.1 GND.1 LCD.1 LCD.12 LCD.13 LCD.14 LED1.3 LED2.3 LED3.3 LED4.3 LED5.1 R3.1 R6.2 R7.1 R8.2 R9.2 RST.1 SW1.4 SW4.6 SW4.7 SW4.C SW4.D U2.0 U2.A1 U2.A12 U2.B1 U2.B12 U3.5 U3.6 U4.19 U4.57 U5.1 U6.2 U6.4 U7.4 U7.9
B_1: BT1.2 U4.15
B_2: BT2.2 U4.16
B_3: BT3.2 U4.17
B_RE: SW4.E U4.31
BCKLED_PWM: R2.1 U4.13
CS: LCD.2 R4.1 U4.7
D+: U2.A6 U2.B6 U3.8 USBIN+.1
D-: U2.A7 U2.B7 U3.7 USBIN-.1
D/C: LCD.3 R6.1 U4.12
LED_K: LCD.11 R1.2
QSPI_SCLK: U4.52 U7.6
QSPI_SD0: U4.53 U7.5
QSPI_SD1: U4.55 U7.2
QSPI_SD2: U4.54 U7.3
QSPI_SD3: U4.51 U7.7
QSPI_SS: R14.2 R15.2 U4.56 U7.1
RE_A: SW4.A U4.27
RE_B: SW4.B U4.28
RGB_LED: LED4.4 U4.30
RP_D2+: R11.2 U3.3 USBOUT+.1
RP_D2-: R12.2 U3.4 USBOUT-.1
RP_LED: R17.1 U4.37
RST: LCD.6 R5.1 U4.11
SPI_CLOCK: LCD.4 U4.4
SPI_MOSI: LCD.5 U4.5
UART_ENABLE: SW1.2 U4.29
UART_RX: RX.1 U3.2 U4.3
UART_TX: TX.1 U3.1 U4.2
USB_SEL: R10.2 SW1.1 U3.9
VUSB: C12.2 LED1.1 LED2.1 LED3.1 LED4.1 U2.A4 U2.A9 U2.B4 U2.B9 U5.3
XIN: C15.1 U4.20 U6.1
XOUT: R16.1 U4.21
$1N3240: LED5.2 R17.2
$1N3243: C16.2 R16.2 U6.3
$1N3253: BOOT.1 R14.1
$1N3266: R13.1 RST.2 U4.26
$1N3267: R11.1 U4.47
$1N3269: R12.1 U4.46
$1N3437: R7.2 U2.A5
$1N3441: R8.1 U2.B5
$1N3877: R9.1 SW1.3
$1N4083: BACKLIGHT GPIO10.1 R2.2 R3.2
$1N4249: BACKLIGHT GPIO10.3 R1.1
$1N5974: LED1.4 LED2.2
$1N6041: LED3.4 LED4.2
$1N6047: LED2.4 LED3.2

Pads without a net: BT1 1 3; BT2 1 3; BT3 1 3; LCD 7; LED1 2; SCREW1 1; SCREW2 1; SCREW3 1; SCREW4 1; U4 6 8 9 14 18 24 25 32 34 35 36 38 39 40 41

## Via types
v1: diameter 0.61, hole 0.305, Top Layer to Bottom Layer, 92 vias

## Routing (per net, layer and track width the routed paths; a pad name or vN(x,y) marks a point on that pad's centre or on a via; arc(x,y) is an arc through that point)
1V1: length 26.6
  Top Layer w0.254: 35.68,27.76 37.22,27.76 37.58,28.11 37.58,31.26 37.12,31.72 35.34,31.72 34.87,32.19 U4.23 34.85,33.37 34.85,34.02 34.78,34.09 C9.2 ; 35.68,27.76 34.53,27.76 33.7,26.92 33.7,26.27 33.68,26.25 33.68,23.04 33.16,22.52 C11.2 ; 35.68,27.76 35.68,26.25 35.65,26.23 35.65,22.2 C8.2
3V3: length 157.2
  Top Layer w0.254: 35.19,25.06 35.28,25.15 35.28,26.25 ; 35.19,25.06 35.19,21.19 35.34,21.04 35.56,21.04 v1(36.1,20.5) ; 35.19,25.06 34.87,25.38 U4.48 ; v1(40.6,30.3) 40.83,30.53 40.83,30.8 ; v1(47.6,28.4) 48.52,28.4 R5.2 ; C2.2 32.48,25.44 33.19,25.44 33.28,25.52 33.28,27.13 v1(33,27.4) ; 40.83,30.8 C5.2 ; 40.83,30.8 39.03,30.8 ; 47.6,17.68 42.95,13.03 C7.2 ; 47.6,17.68 C13.2 ; 47.6,17.68 43.52,17.68 42.9,18.3 42.9,19.31 R15.1 39.43,19.35 39.05,19.73 39.05,20.22 C14.2 38.23,21.07 U7.8 ; v1(33,30.8) 31.93,30.8 U4.33 C4.2 ; U3.10 41.63,12.56 C7.2 ; U4.43 32.87,27.28 32.8,27.2 U4.42 30.93,27.2 30.25,26.52 C3.2 ; R10.1 43.29,11.83 C7.2 ; v1(35.89,32.35) 35.35,32.35 35.28,32.43 35.28,33.35 ; R4.2 48.52,24.79 U5.4 ; 51.86,30.03 52.46,29.44 LCD.8 ; v1(38,27.3) 38.1,27.2 U4.1 39.5,26.73 41.25,26.73 C6.2 ; R13.2 33.51,37.39 v1(33.4,37.5)
  Top Layer w0.305: 52.31,30.03 49.56,30.03 ; 52.31,30.03 52.71,30.44 LCD.10 ; 52.31,30.03 52.36,30.03 52.46,29.93 53.53,29.93 LCD.9
  Top Layer w0.508: 53.5,17.67 U5.4 ; 53.5,17.67 53.49,17.68 49.96,17.68 ; 53.5,17.67 U5.2 ; 49.96,17.68 C13.2 ; 49.96,17.68 48.54,19.1 3V3.1 ; LCD.9 54.86,29.94 v1(55.1,29.7)
  Bottom Layer w0.254: 33.56,27.4 33.56,30.24 v1(33,30.8) ; 37.62,27.72 37.62,27.68 v1(38,27.3) ; v1(40.6,30.3) 38.1,30.3 37.92,30.48 37.92,32.1 37.74,32.28 35.97,32.28 v1(35.89,32.35) 33.75,32.35 33.4,32.7 v1(33.4,37.5) ; 53.3,28.1 53,28.4 v1(47.6,28.4)
  Bottom Layer w0.305: 36.3,26.6 35.5,27.4 v1(33,27.4)
  Bottom Layer w0.508: 38,30.3 38,28.1 37.62,27.72 36.1,26.2 v1(36.1,20.5) 36.1,19.1 39.1,16.1 49.5,16.1 v1(51.1,17.7) 52.8,19.4 52.8,27.4 v1(55.1,29.7)
GND: length 8.8
  Top Layer w0.254: v1(41.08,20.24) C14.1 40.15,23.01 U7.9 v1(41.08,23.98) 41.33,24.24 U7.4 ; 36.6,35.3 36.6,34.12 36.5,34.02 36.5,33.37 U4.19 ; R6.2 48.12,26.58 v1(48,26.58)
  vias: v1(5.4,52.3) v1(10.5,46.6) v1(17,46.9) v1(20.2,15.7) v1(22.2,43.1) v1(23.4,9.4) v1(25.8,49.7) v1(26.6,29.9) v1(27,24.3) v1(28.3,18.2) v1(28.8,3.6) v1(33.2,45) v1(34.5,30.7) v1(34.5,28.9) v1(35.4,44.9) v1(35.8,18.3) v1(36.4,30.7) v1(36.4,28.9) v1(36.7,36.6) v1(36.9,39.1) v1(37.7,44.9) v1(40.7,48.1) v1(42.1,42.7) v1(43.3,15) v1(44.2,26.7) v1(44.8,30.7) v1(45.5,13.1) v1(45.7,37.8) v1(46.9,22.2) v1(48.3,11.7) v1(48.6,31.7) v1(51,29.1) v1(51.1,24.2) v1(51.9,16.3) v1(55.1,17.1) v1(55.1,3.1) v1(56,48.3) v1(57.3,26.5) v1(60.5,41.5) v1(64,29.9) v1(64.4,12.4) v1(72.8,23.2) v1(75.7,46.9) v1(84.6,12.3)
(no net): length 4.2
  Top Layer w0.254: 39.03,32.4 39.5,32.88 39.5,36.4
B_1: length 52.4
  Top Layer w0.254: BT1.2 84.03,39.9 v1(85.9,39.9) ; U4.15 v1(38.76,34.04)
  Bottom Layer w0.254: v1(85.9,39.9) 84,38 77.5,38 73.54,34.04 v1(38.76,34.04)
B_2: length 51.6
  Top Layer w0.254: 37.68,33.35 37.68,34.38 v1(38.2,34.9) ; BT2.2 82.62,29.87 v1(75.2,37.3)
  Bottom Layer w0.254: v1(75.2,37.3) 72.8,34.9 v1(38.2,34.9)
B_3: length 59.8
  Top Layer w0.254: BT3.2 83.32,19.87 82.3,20.9 82.3,27.4 v1(73.2,36.5) ; 37.28,33.35 37.3,33.37 37.3,34.82 37.9,35.43 v1(37.9,35.9)
  Bottom Layer w0.254: v1(73.2,36.5) 72.6,35.9 v1(37.9,35.9)
B_RE: length 22.5
  Top Layer w0.254: v1(29.8,31.4) 31.08,31.4 31.26,31.58 31.9,31.58 U4.31
  Bottom Layer w0.254: v1(29.8,31.4) 29.55,31.15 26.15,31.15 23.1,34.2 12.89,34.2 SW4.E
BCKLED_PWM: length 14.6
  Top Layer w0.254: U4.13 40.06,32 40.32,32.27 40.32,37.17 R2.1
CS: length 18.8
  Top Layer w0.203: v1(46.57,29.42) 46.11,29.88 41.24,29.88 40.96,29.6 U4.7 ; R4.1 49.39,25.08 49.01,25.46 48.19,25.46 46.67,26.98 v1(46.62,26.98)
  Top Layer w0.254: R4.1 50.63,24.9 52.17,26.44 LCD.2
  Bottom Layer w0.203: v1(46.62,26.98) 46.57,27.04 v1(46.57,29.42)
D+: length 14.2
  Top Layer w0.254: 41.89,9.51 43.02,9.51 44.6,7.93 44.6,7.5 44.85,7.26 U2.A6 44.85,6.15 U2.B6 ; 41.89,9.51 42.48,10.1 44.42,10.1 44.59,9.93 USBIN+.1 ; 41.89,9.51 40.8,9.51 39.56,10.75 39.56,11.32 39.61,11.37 U3.8
D-: length 15.2
  Top Layer w0.254: 41.85,9.1 42.85,9.1 44.2,7.76 44.2,7.5 43.95,7.26 U2.A7 ; 41.85,9.1 41.15,8.4 38.53,8.4 USBIN-.1 ; 41.85,9.1 40.63,9.1 39.15,10.58 39.15,11.32 39.11,11.37 U3.7
  Bottom Layer w0.254: U2.B7 44.85,5.75 U2.A7
D/C: length 28.4
  Top Layer w0.254: R6.1 50.94,26.17 51.7,26.93 53.53,26.93 ; U4.12 41.1,31.6 42.4,32.9 53.7,32.9 v1(54.1,32.5) ; LCD.3 54.74,26.94 v1(55.2,27.4)
  Bottom Layer w0.254: v1(54.1,32.5) 56.1,30.5 56.1,28.3 v1(55.2,27.4)
LED_K: length 9.5
  Top Layer w0.305: R1.2 55.76,37.3 54.95,36.48 54.95,31.45 54.44,30.94 LCD.11
QSPI_SCLK: length 4.4
  Top Layer w0.203: U7.6 36.77,23.44 36.46,23.74 36.46,26.24 U4.52
QSPI_SD0: length 3.1
  Top Layer w0.203: U4.53 36.87,26.24 36.87,24.66 37.29,24.24 U7.5
QSPI_SD1: length 10.5
  Top Layer w0.203: 37.68,26.25 37.68,25.55 37.93,25.29 43.49,25.29 43.67,25.11 43.67,23.54 42.77,22.64 U7.2
QSPI_SD2: length 9
  Top Layer w0.203: 37.28,26.25 37.27,26.25 37.27,25.42 37.78,24.91 42.81,24.91 43.06,24.66 43.06,23.69 42.81,23.44 U7.3
QSPI_SD3: length 5.3
  Top Layer w0.203: U7.7 36.86,22.64 36.1,23.39 36.1,26.22 U4.51
QSPI_SS: length 14.9
  Top Layer w0.203: U4.56 38.07,26.09 38.51,25.65 44.08,25.65 44.33,25.4 44.33,23.44 42.73,21.84 U7.1
  Top Layer w0.254: U7.1 42.03,21.04 R15.2 42.87,20.2 R14.2
RE_A: length 33.5
  Top Layer w0.254: 33.28,33.35 33.25,33.37 33.25,34.02 32.87,34.4 24.1,34.4 v1(21.4,31.7)
  Bottom Layer w0.254: v1(21.4,31.7) 12.7,23 7.8,23 6.36,21.56 SW4.A
RE_B: length 26.5
  Top Layer w0.254: U4.28 24.75,33.35 v1(22,30.6)
  Bottom Layer w0.254: SW4.B 12.55,21.15 v1(22,30.6)
RGB_LED: length 52.8
  Top Layer w0.254: U4.30 28.1,32 v1(27.9,31.8)
  Bottom Layer w0.254: 53.94,50.45 53.94,51.36 52.82,52.48 27.58,52.48 27.4,52.3 27.4,32.3 v1(27.9,31.8)
RP_D2+: length 8.7
  Top Layer w0.254: 36.02,14.64 36,14.65 USBOUT+.1 ; 36.02,14.64 38.64,14.64 39.06,14.22 39.06,13.8 39.11,13.75 U3.3 ; 36.02,14.64 35.36,14.64 34.12,15.88 34.12,16.13 R11.2
RP_D2-: length 8.7
  Top Layer w0.254: 36.01,14.23 36,14.22 USBOUT-.1 ; 36.01,14.23 38.47,14.23 38.65,14.05 38.65,13.8 38.61,13.75 U3.4 ; 36.01,14.23 35.2,14.23 33.72,15.71 33.72,16.13 R12.2
RP_LED: length 33
  Top Layer w0.254: R17.1 7.42,44.28 22.5,29.2 U4.37
RST: length 16.5
  Top Layer w0.254: 49.41,28.41 49.41,28.76 49.11,29.07 47.84,29.07 45.15,31.76 42.2,31.76 41.64,31.2 U4.11 ; 49.41,28.41 49.41,28.31 ; 49.41,28.41 53.5,28.41 LCD.6
SPI_CLOCK: length 15.6
  Top Layer w0.203: 39.03,28.4 40.92,28.4 41.42,28.9 41.88,28.9 42.38,28.4 45.99,28.4 47.26,27.14 50.94,27.14 51.24,27.44 LCD.4
SPI_MOSI: length 15.6
  Top Layer w0.203: U4.5 40.77,28.8 41.29,29.32 41.95,29.32 42.56,28.71 46.11,28.71 47.28,27.54 50.79,27.54 51.18,27.94 LCD.5
UART_ENABLE: length 37.8
  Top Layer w0.254: 31.92,32.4 26.6,32.4 v1(25.1,30.9) ; v1(24.7,28.4) 7.15,10.85 4.24,10.85
  Bottom Layer w0.254: v1(25.1,30.9) 25.1,28.8 v1(24.7,28.4)
UART_RX: length 20.2
  Top Layer w0.203: v1(39.47,18.46) 39.47,18.43 39.65,18.25 39.65,17.02 ; U3.2 39.61,13.75 39.65,13.8 39.65,17.02 ; 39.65,17.02 38.31,17.02 RX.1
  Top Layer w0.254: 39.03,28.01 41.32,28.01 v1(41.65,28.34)
  Bottom Layer w0.203: v1(39.47,18.46) 39.47,19.37 39.65,19.55 39.65,25.66 39.68,25.68 39.68,26.03 41.14,27.49 41.14,27.83 v1(41.65,28.34)
UART_TX: length 20.4
  Top Layer w0.203: U3.1 40.11,13.75 40.06,13.8 40.06,17.02 ; 40.06,17.02 41.57,17.02 TX.1 ; 40.06,17.02 40.06,18.28 v1(40.24,18.46)
  Top Layer w0.254: v1(42.03,27.6) 41.68,27.24 40.32,27.24 39.96,27.6 U4.2
  Bottom Layer w0.203: v1(42.03,27.6) 41.68,27.24 41.39,27.24 40.03,25.88 40.03,25.68 40.06,25.66 40.06,19.5 40.24,19.32 v1(40.24,18.46)
USB_SEL: length 41.7
  Top Layer w0.254: v1(10.1,12.1) 35.7,12.1 v1(37.2,10.6) ; U3.9 40.5,11.49 41.38,11.49 ; 4.24,13.85 7.75,13.85 v1(8.5,13.1) ; 41.38,11.49 41.2,11.31 v1(41.2,10.7) ; 41.38,11.49 R10.2
  Bottom Layer w0.254: v1(37.2,10.6) 41.1,10.6 v1(41.2,10.7) ; v1(8.5,13.1) 9.5,12.1 v1(10.1,12.1)
VUSB: length 141.2
  Top Layer w0.305: v1(49.1,7) 49.1,5.95 49.14,5.91 53.01,5.91 55.8,8.7 U5.3 ; 46.79,46 46.2,46.59 v1(46.2,49.9) ; v1(31.2,49.5) 31.2,46.64 31.84,46 ; v1(72.3,38.8) 71.09,38.8 71,38.71
  Top Layer w0.35: 46.7,6.38 47.1,5.98 49.08,5.98 49.1,5.95
  Top Layer w0.508: v1(15.5,38.8) 16.2,38.1 22.8,38.1 30.7,46 64.8,46 71,39.8 71,29.55 59,17.55 C12.2 57.71,16.96 57.69,16.96 57.45,16.72 57.45,16.7 55.8,15.05 U5.3 ; U2.B9 U2.A4 ; U2.B4 U2.A9
  Bottom Layer w0.305: LED2.1 73.05,39.55 v1(72.3,38.8) ; LED3.1 32.15,50.45 v1(31.2,49.5) ; v1(49.1,7) 47.3,8.8 45,8.8 42.85,6.65 U2.A9 ; LED4.1 46.75,50.45 v1(46.2,49.9)
  Bottom Layer w0.308: LED1.1 14.25,40.05 v1(15.5,38.8)
XIN: length 12.6
  Top Layer w0.203: U6.1 35.75,41.82 35.75,39.03 36.03,38.75 36.03,33.4 U4.20
  Top Layer w0.254: U6.1 36.97,42.99 C15.1
XOUT: length 5.7
  Top Layer w0.203: 35.09,38.86 35.65,38.3 35.65,33.38 35.68,33.35
$1N3240: length 1.7
  Top Layer w0.254: LED5.2 4.31,42.72 R17.2
$1N3243: length 3.9
  Top Layer w0.254: R16.2 35.09,40.56 34.74,40.9 U6.3 32.77,41.31 C16.2
$1N3253: length 41.2
  Top Layer w0.254: v1(61.6,18.2) 69.24,18.2 BOOT.1 ; v1(45.9,19.5) 44.29,19.5 44.13,19.34 ; v1(51.4,23.2) 52.7,21.9 v1(54.1,21.9)
  Bottom Layer w0.254: v1(61.6,18.2) 57.9,21.9 v1(54.1,21.9) ; v1(51.4,23.2) 49.6,23.2 v1(45.9,19.5)
$1N3266: length 70.2
  Top Layer w0.254: v1(83.9,6.2) 82.94,5.24 RST.2 ; 33.68,34.4 33.68,33.35 ; 33.68,34.4 v1(34.2,34.4) ; 33.68,34.4 33.68,35.54 R13.1
  Bottom Layer w0.254: v1(34.2,34.4) 36.6,34.4 38.3,32.7 52.8,32.7 53.4,33.3 55.9,33.3 62.3,26.9 62.3,20.9 76.1,7.1 83,7.1 v1(83.9,6.2)
$1N3267: length 8.4
  Top Layer w0.254: R11.1 34.12,18.86 34.12,19.73 34.48,20.09 34.48,26.25
$1N3269: length 8.4
  Top Layer w0.254: R12.1 33.72,18.86 33.72,19.9 34.05,20.24 34.05,26.23 U4.46
$1N3437: length 4.4
  Top Layer w0.254: U2.A5 45.77,6.63 45.77,5.04 45.06,4.33 R7.2
$1N3441: length 3
  Top Layer w0.254: R8.1 43.79,4.51 U2.B5
$1N3877: length 2.8
  Top Layer w0.254: 4.24,9.35 4.58,9.01 5.64,9.01 5.82,8.83 5.82,8.14 5.58,7.91
$1N4083: length 4.9
  Top Layer w0.254: BACKLIGHT GPIO10.1 51.2,42.66 R3.2 49.03,43.04 R2.2
$1N4249: length 2.8
  Top Layer w0.305: R1.1 54.13,42.12 BACKLIGHT GPIO10.3
$1N5974: length 76.9
  Bottom Layer w0.254: LED2.2 75.27,41.42 75.32,41.42 75.68,41.78 75.68,41.83 77.1,43.25 77.1,47.9 76.9,48.1 63.4,48.1 58.1,53.4 25.8,53.4 20.3,47.9 14.9,47.9 14.25,47.25 LED1.4
$1N6041: length 10
  Bottom Layer w0.254: 38.94,50.45 38.99,50.4 43.1,50.4 44.55,48.95 LED4.2
$1N6047: length 41.3
  Bottom Layer w0.254: LED3.2 33.34,48.06 34.6,46.8 72.55,46.8 LED2.4

## Copper pours and planes (outline as drawn; the poured copper is in the pictures)
GND on Top Layer: -9.4,64.5 96.8,64.5 96.8,-4.5 -9.4,-4.5
GND on Bottom Layer: -10.1,61.7 102.3,61.7 102.3,-4.9 -10.1,-4.9

## Text on the board
Top Silkscreen Layer: USB/UART | USB ONLY
